# Altium schematic sheet SD_RTC_SPI.SchDoc
size A0; SheetNumber: 6; SheetTotal: 12
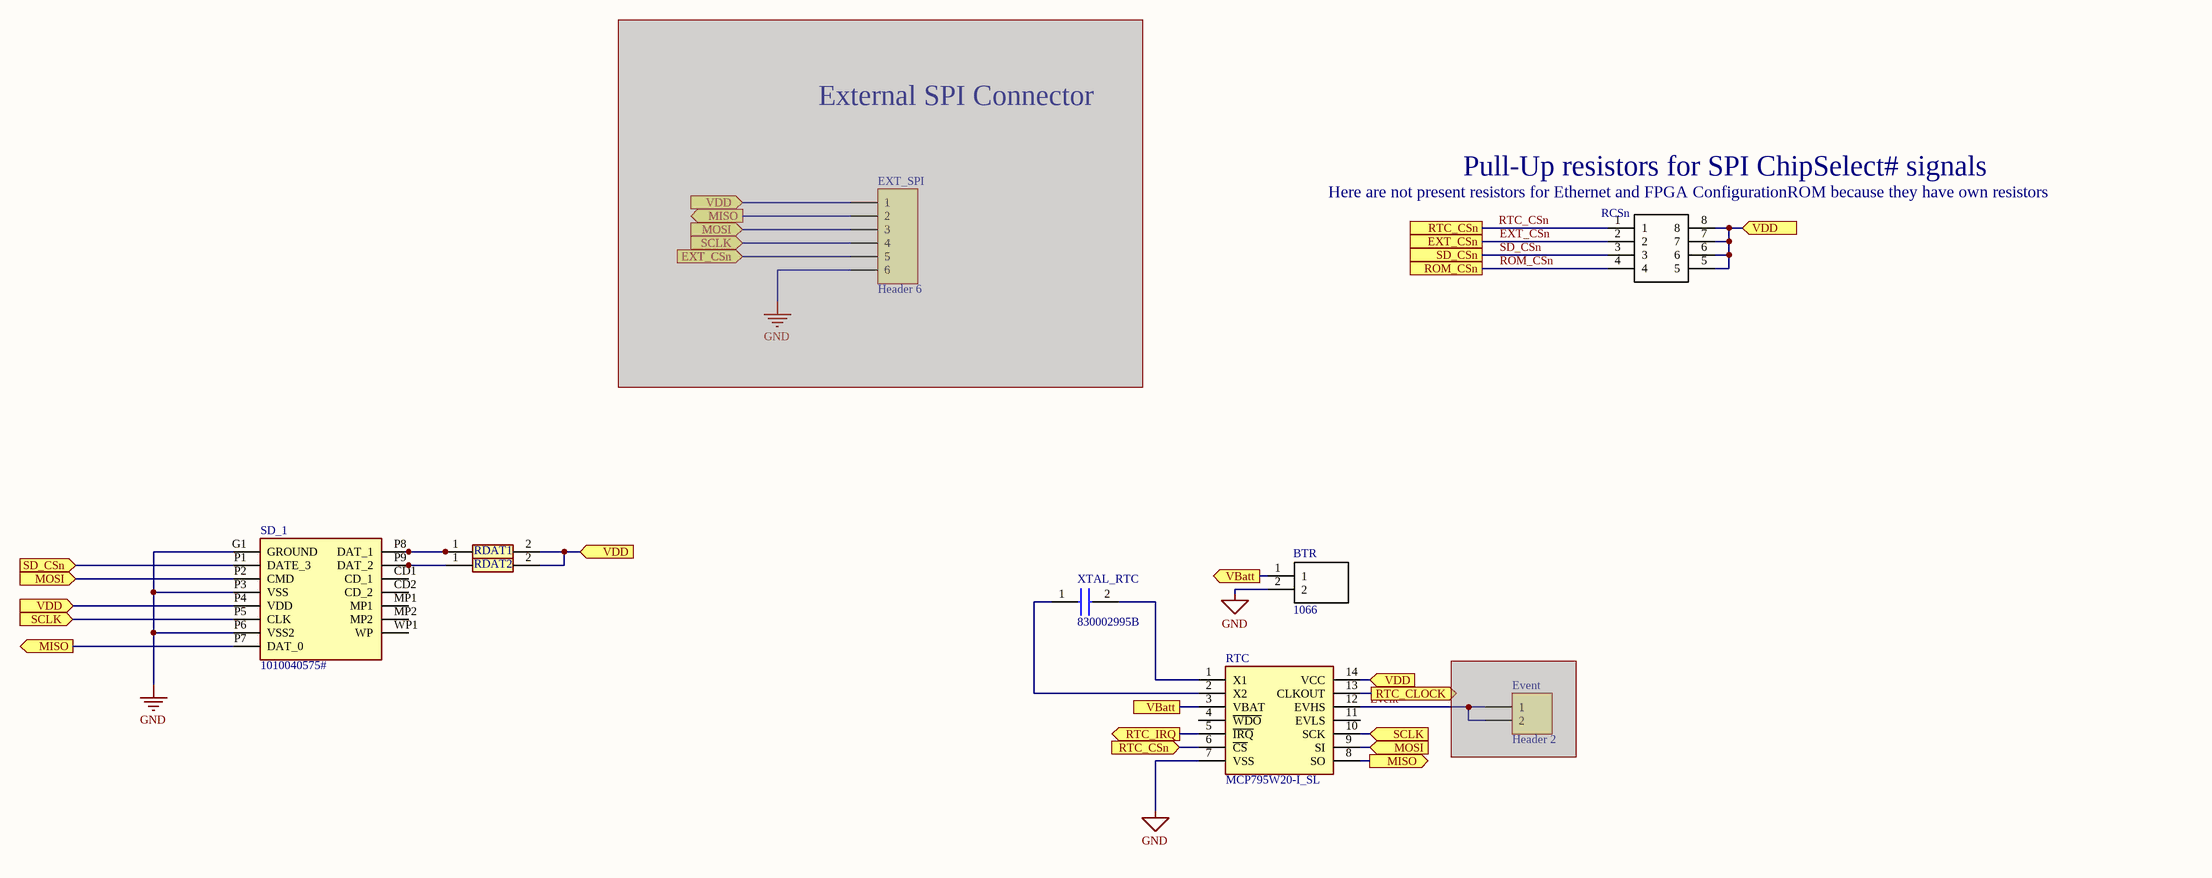
[diagram p0: SD_RTC_SPI.SchDoc]

## Parts
BTR  1066  [1066]
Event  Header 2  [HDR1X2]  (masked out: inside a compile mask, not in the netlist)
EXT_SPI  Header 6  [HDR1X6]  (masked out: inside a compile mask, not in the netlist)
RCSn  CAT16A-1002F4LF  [CAT16A1002F4LF]  (value not drawn)
RDAT1  CRCW060310K0FKEC  [RESC1608X50N]  (value not drawn)
RDAT2  CRCW060310K0FKEC  [RESC1608X50N]  (value not drawn)
RTC  MCP795W20-I_SL  [SOIC127P600X175-14N]
SD_1  1010040575#  [1010040575]
XTAL_RTC  830002995B  [830002995B]

## Ports
EXT_CSn, EXT_CSn (in), MISO (out), MOSI (in), ROM_CSn, RTC_CLOCK (out), RTC_CSn, RTC_CSn (in), RTC_IRQ (out), SCLK (in), SD_CSn, SD_CSn (in), VBatt, VBatt (out), VDD (in)

## Nets
GND: BTR.2 RTC.7(VSS) SD_1.G1(GROUND) SD_1.P3(VSS) SD_1.P6(VSS2)
Event: RTC.12(EVHS)
EXT_CSn: RCSn.2 ; port EXT_CSn
MISO: RTC.8(SO) SD_1.P7(DAT_0) ; port MISO
MOSI: RTC.9(SI) SD_1.P2(CMD) ; port MOSI
ROM_CSn: RCSn.4 ; port ROM_CSn
RTC_CLOCK: RTC.13(CLKOUT) ; port RTC_CLOCK
RTC_CSn: RCSn.1 RTC.6(~{CS}) ; port RTC_CSn
RTC_IRQ: RTC.5(~{IRQ}) ; port RTC_IRQ
SCLK: RTC.10(SCK) SD_1.P5(CLK) ; port SCLK
SD_CSn: RCSn.3 SD_1.P1(DATE_3) ; port SD_CSn
VBatt: BTR.1 RTC.3(VBAT) ; port VBatt
VDD: RCSn.5 RCSn.6 RCSn.7 RCSn.8 RDAT1.2 RDAT2.2 RTC.14(VCC) SD_1.P4(VDD) ; port VDD
NetRDAT1_1: RDAT1.1 SD_1.P8(DAT_1)
NetRDAT2_1: RDAT2.1 SD_1.P9(DAT_2)
NetRTC_1: RTC.1(X1) XTAL_RTC.2(CRYSTAL_2)
NetRTC_2: RTC.2(X2) XTAL_RTC.1(CRYSTAL_1)

Not connected (* = marked no-connect by the designer): RTC 4(~{WDO}) 11(EVLS); SD_1 CD1(CD_1) CD2(CD_2) MP1 MP2 WP1(WP)

## Notes on the sheet
- External SPI Connector
- (near RCSn) Pull-Up resistors for SPI ChipSelect# signals
- (near RCSn) Here are not present resistors for Ethernet and FPGA ConfigurationROM because they have own resistors

## Library data of the parts
BTR = 1066: Undefined or Miscellaneous; Manufacturer_Name: Keystone Electronics; Datasheet Link: http://keyelco.com/userAssets/file/M65p5.pdf; Height: 9.85mm; Manufacturer_Part_Number: 1066; Mouser Part Number: 534-1066; Mouser Price/Stock: https://www.mouser.co.uk/ProductDetail/Keystone-Electronics/1066?qs=TMDrOSIpnUfyx7dWA5t7YA%3D%3D
Event = Header 2: Header, 2-Pin; LatestRevisionDate: 17-Jul-2002; LatestRevisionNote: Re-released for DXP Platform.; Publisher: Altium Limited
EXT_SPI = Header 6: Header, 6-Pin; LatestRevisionDate: 17-Jul-2002; LatestRevisionNote: Re-released for DXP Platform.; Publisher: Altium Limited
RCSn = CAT16A-1002F4LF: Resistor Network; Manufacturer_Name: Bourns; Datasheet Link: https://www.bourns.com/docs/product-datasheets/cat16a-lf.pdf?sfvrsn=f78c48f6_4; Height: 0.65mm; Manufacturer_Part_Number: CAT16A-1002F4LF; Mouser Part Number: 652-CAT16A-1002F4LF; Mouser Price/Stock: https://www.mouser.co.uk/ProductDetail/Bourns/CAT16A-1002F4LF?qs=IS%252B4QmGtzzqwI8c1abvAYA%3D%3D
RDAT1 RDAT2 = CRCW060310K0FKEC: Resistor; Manufacturer_Name: Vishay; Datasheet Link: http://www.vishay.com/docs/20035/dcrcwe3.pdf; Height: 0.5mm; Manufacturer_Part_Number: CRCW060310K0FKEC; Mouser Part Number: 71-CRCW060310K0FKEC; Mouser Price/Stock: https://www.mouser.co.uk/ProductDetail/Vishay-Dale/CRCW060310K0FKEC?qs=DhCTQV%252BB7kVUX5brQUG3LA%3D%3D; Arrow Part Number: CRCW060310K0FKEC; Arrow Price/Stock: https://www.arrow.com/en/products/crcw060310k0fkec/vishay?region=nac
RTC = MCP795W20-I_SL: Integrated Circuit; Manufacturer_Name: Microchip; Manufacturer_Part_Number: MCP795W20-I/SL; Datasheet Link: http://www.microchip.com/mymicrochip/filehandler.aspx?ddocname=en556469; Height: 1.75mm; Mouser Part Number: 579-MCP795W20-I/SL; Mouser Price/Stock: https://www.mouser.co.uk/ProductDetail/Microchip-Technology/MCP795W20-I-SL?qs=tc5aKIj3JEqUBv0X09nRdg%3D%3D; Arrow Part Number: MCP795W20-I/SL; Arrow Price/Stock: https://www.arrow.com/en/products/mcp795w20-isl/microchip-technology
SD_1 = 1010040575#: Connector; Manufacturer_Name: Amphenol Communications Solutions; Datasheet Link: https://cdn.amphenol-cs.com/media/wysiwyg/files/drawing/1010040575.pdf; Height: 4.8mm; Manufacturer_Part_Number: 1010040575#; Mouser Part Number: 523-1010040575#; Mouser Price/Stock: https://www.mouser.co.uk/ProductDetail/Amphenol-Commercial-Products/1010040575?qs=ToP8pWlZ0bNfojQLHmjlUA%3D%3D; Arrow Part Number: 1010040575#; Arrow Price/Stock: https://www.arrow.com/en/products/1010040575/amphenol
XTAL_RTC = 830002995B: Capacitor; Manufacturer_Name: Wurth Elektronik; Datasheet Link: https://www.mouser.de/datasheet/2/445/830002995B-2005217.pdf; Height: 8.2mm; Manufacturer_Part_Number: 830002995B; Mouser Part Number: 710-830002995B; Mouser Price/Stock: https://www.mouser.co.uk/ProductDetail/Wurth-Elektronik/830002995B?qs=2WXlatMagcHCnw26vHVZcg%3D%3D